# EAGLE design GlassHeat (EAGLE 6.5.0)
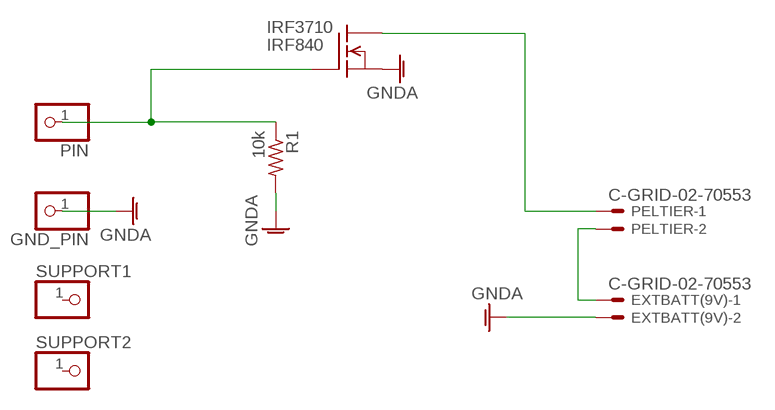
[diagram p0: schematic, sheet 1]

## Parts
EXTBATT(9V)  C-GRID-02-70553  [70553-02]
GND_PIN  PINHD-1X1  [1X01]
IRF3710  IRF840  [TO220]
PELTIER  C-GRID-02-70553  [70553-02]
PIN  PINHD-1X1  [1X01]
R1  10k  R-US_0207/7  [0207/7]
SUPPORT1  PINHD-1X1  [1X01]
SUPPORT2  PINHD-1X1  [1X01]

## Nets
GNDA: EXTBATT(9V).2 GND_PIN.1 IRF3710.3(S) R1.2
N$1: IRF3710.1(G) PIN.1 R1.1
N$2: IRF3710.2(D) PELTIER.1
N$3: EXTBATT(9V).1 PELTIER.2
Unconnected: SUPPORT1.1 SUPPORT2.1

## Library data of the parts
EXTBATT(9V) PELTIER = con-molex:C-GRID-02: CONNECTOR wire to board 2.54 mm (0.100") pitch header; OC_FARNELL: unknown; OC_NEWARK: unknown
GND_PIN PIN SUPPORT1 SUPPORT2 = pinhead:PINHD-1X1: PIN HEADER
IRF3710 = transistor-fet:IRF840: N-Channel Enhancement MOSFET (HEXFET); 500V; 8A; 0,85Ohm
R1 = rcl:R-US_: RESISTOR, American symbol

## Board
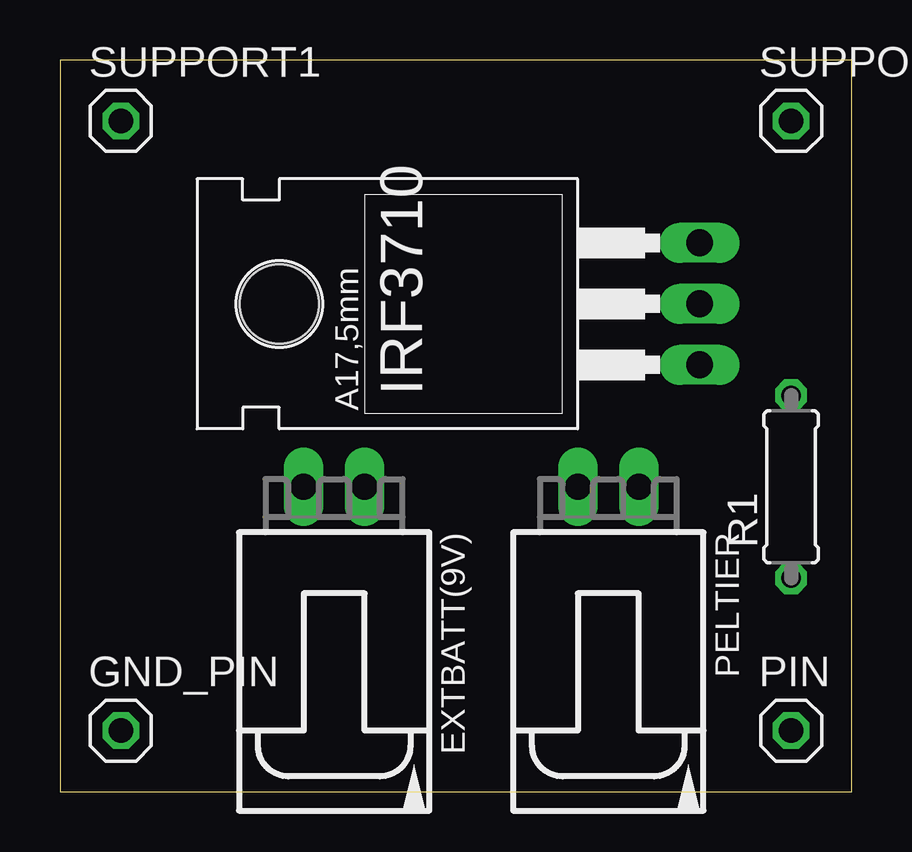
[diagram p1: board, top side]
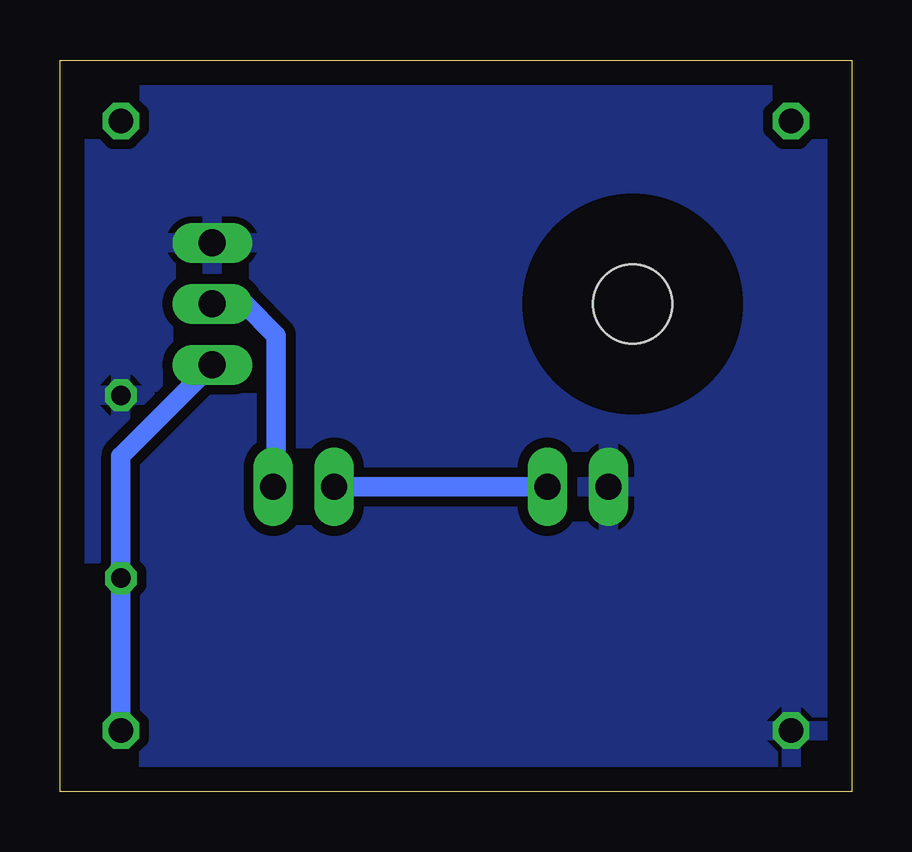
[diagram p2: board, bottom side, seen from below]

Size 33.02 x 30.48 mm. Coordinates in mm from the lower left corner, seen from the top.
Outline: 0,0 33.02,0 33.02,30.48 0,30.48 0,0
Copper layers (1*16): Top 0.035mm / dielectric 1.5mm / Bottom 0.035mm
Design rules "default": minimum track width 10mil, minimum drill 24mil, track to track 8mil, track to pad 8mil, pad to pad 8mil, via to via 8mil, smd to smd 8mil, copper to edge 40mil, drill to drill 8mil, minimum pad ring 10mil, minimum via ring 8mil, stop-mask expansion 4mil, vias tented up to drill 0mil, thermal gap 10mil

### Footprints (pad centres in the part's own frame; a part is rotated, then mirrored left to right if it is on the bottom)
70553-02 = drill 1.092 long: 1 -1.27,-7.62; 2 1.27,-7.62
1X01 = drill 1.016 octagon: 1 0,0
TO220 = drill 1.118 long: 1 -2.54,-6.35; 2 0,-6.35; 3 2.54,-6.35 | hole 3.302: 0,11.176
0207/7 = drill 0.813 octagon: 1 -3.81,0; 2 3.81,0

### Placement (x,y rotation side)
EXTBATT(9V)  11.43,5.08 180 top
GND_PIN  2.54,2.54 0 top
IRF3710  20.32,20.32 90 top
PELTIER  22.86,5.08 180 top
PIN  30.48,2.54 0 top
R1  30.48,12.7 90 top
SUPPORT1  2.54,27.94 0 top
SUPPORT2  30.48,27.94 0 top

### Tracks (layer width: path | path; a pad name or v marks a point on that pad's centre or on a via)
GNDA
  pour Bottom (isolate 0.406): 0,30.48 33.02,30.48 33.02,0 0,0
N$1
  Bottom 0.813: PIN.1 R1.1 30.48,13.97 IRF3710.1
N$2
  Bottom 0.813: IRF3710.2 25.32,20.32 24,19 24,12.83 PELTIER.1
N$3
  Bottom 0.813: PELTIER.2 EXTBATT(9V).1